# Altium schematic sheet UI.SchDoc
size A
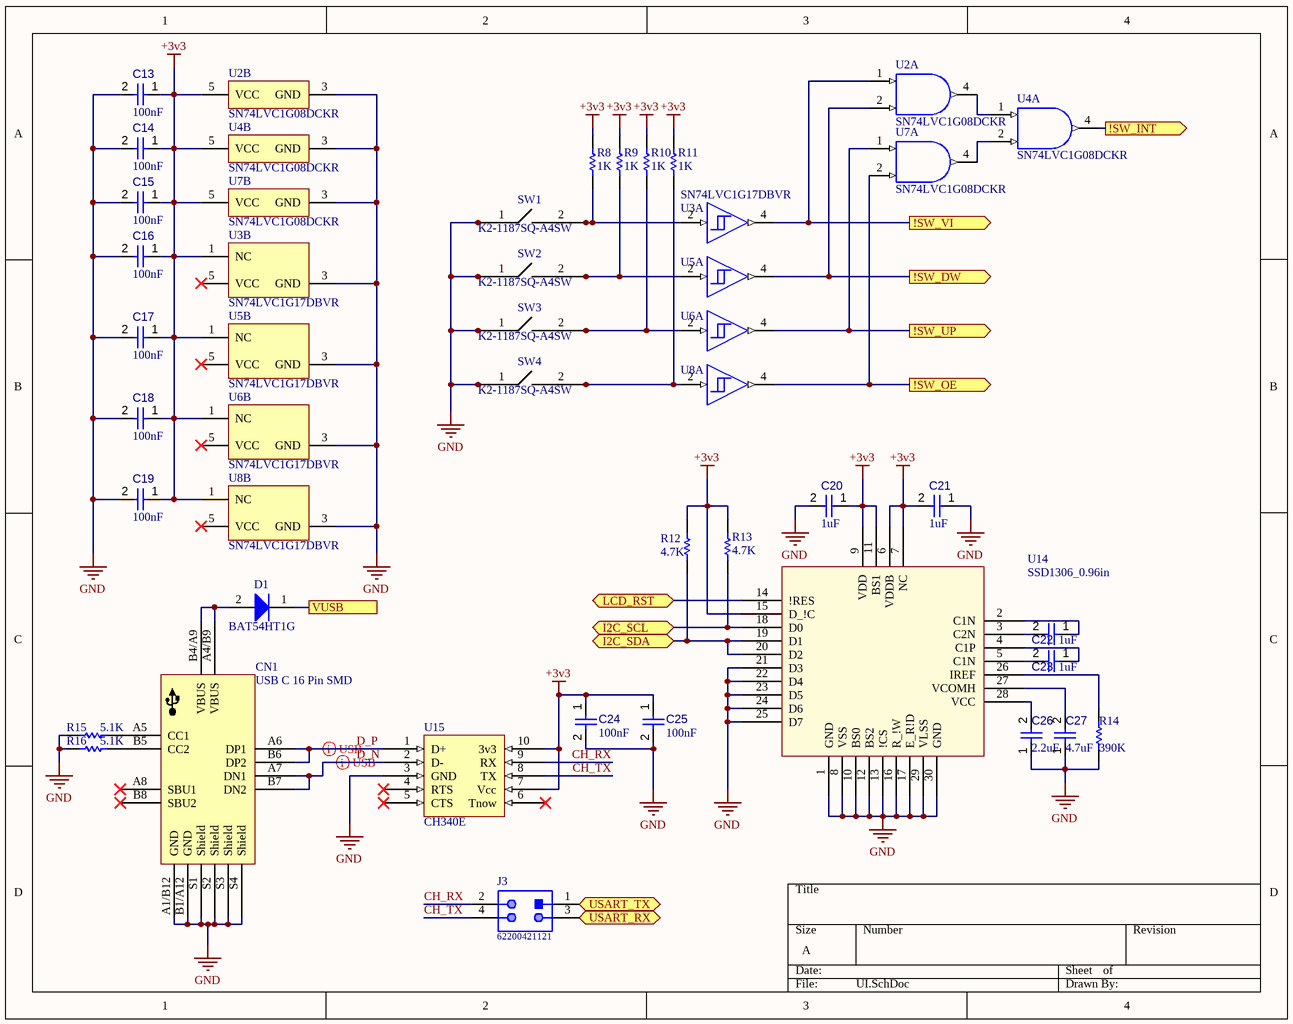
[diagram p0: UI.SchDoc]

## Parts
C13  value 100nF  [CAPC2013X95X50ML10T25]  (hidden comment: Capacitor 100 nF +/-10% 50 V 0805)
C14  value 100nF  [CAPC2013X95X50ML10T25]  (hidden comment: Capacitor 100 nF +/-10% 50 V 0805)
C15  value 100nF  [CAPC2013X95X50ML10T25]  (hidden comment: Capacitor 100 nF +/-10% 50 V 0805)
C16  value 100nF  [CAPC2013X95X50ML10T25]  (hidden comment: Capacitor 100 nF +/-10% 50 V 0805)
C17  value 100nF  [CAPC2013X95X50ML10T25]  (hidden comment: Capacitor 100 nF +/-10% 50 V 0805)
C18  value 100nF  [CAPC2013X95X50ML10T25]  (hidden comment: Capacitor 100 nF +/-10% 50 V 0805)
C19  value 100nF  [CAPC2013X95X50ML10T25]  (hidden comment: Capacitor 100 nF +/-10% 50 V 0805)
C20  value 1uF  [CAPC2013X95X50ML10T25]  (hidden comment: Capacitor 100 nF +/-10% 50 V 0805)
C21  value 1uF  [CAPC2013X95X50ML10T25]  (hidden comment: Capacitor 100 nF +/-10% 50 V 0805)
C22  value 1uF  [CAPC2013X95X50ML10T25]  (hidden comment: Capacitor 100 nF +/-10% 50 V 0805)
C23  value 1uF  [CAPC2013X95X50ML10T25]  (hidden comment: Capacitor 100 nF +/-10% 50 V 0805)
C24  value 100nF  [CAPC2013X95X50ML10T25]  (hidden comment: Capacitor 100 nF +/-10% 50 V 0805)
C25  value 100nF  [CAPC2013X95X50ML10T25]  (hidden comment: Capacitor 100 nF +/-10% 50 V 0805)
C26  value 2.2uF  [CAPC2013X95X50ML10T25]  (hidden comment: Capacitor 100 nF +/-10% 50 V 0805)
C27  value 4.7uF  [CAPC2013X95X50ML10T25]  (hidden comment: Capacitor 100 nF +/-10% 50 V 0805)
CN1  USB C 16 Pin SMD  [USB C 16 Pin SMD-Footprint-1]
D1  BAT54HT1G  [ONSC-SOD-323-2-477-02_V]
J3  62200421121  [62200421121]
R8  value 1K  [RESC2013X50X35ML15T15]  (hidden comment: Resistor 0R +/- 1% 0805 125 mW)
R9  value 1K  [RESC2013X50X35ML15T15]  (hidden comment: Resistor 0R +/- 1% 0805 125 mW)
R10  value 1K  [RESC2013X50X35ML15T15]  (hidden comment: Resistor 0R +/- 1% 0805 125 mW)
R11  value 1K  [RESC2013X50X35ML15T15]  (hidden comment: Resistor 0R +/- 1% 0805 125 mW)
R12  value 4.7K  [RESC2013X50X35ML15T15]  (hidden comment: Resistor 0R +/- 1% 0805 125 mW)
R13  value 4.7K  [RESC2013X50X35ML15T15]  (hidden comment: Resistor 0R +/- 1% 0805 125 mW)
R14  value 390K  [RESC2013X50X35ML15T15]  (hidden comment: Resistor 0R +/- 1% 0805 125 mW)
R15  value 5.1K  [RESC2013X50X35ML15T15]  (hidden comment: Resistor 0R +/- 1% 0805 125 mW)
R16  value 5.1K  [RESC2013X50X35ML15T15]  (hidden comment: Resistor 0R +/- 1% 0805 125 mW)
SW1  K2-1187SQ-A4SW  [K2-1187SQ-A4SW-Footprint-1]
SW2  K2-1187SQ-A4SW  [K2-1187SQ-A4SW-Footprint-1]
SW3  K2-1187SQ-A4SW  [K2-1187SQ-A4SW-Footprint-1]
SW4  K2-1187SQ-A4SW  [K2-1187SQ-A4SW-Footprint-1]
U2  SN74LVC1G08DCKR  [DCK0005A_M]  (parts A,B of 2)
U3  SN74LVC1G17DBVR  [DBV0005A_L]  (parts A,B of 2)
U4  SN74LVC1G08DCKR  [DCK0005A_M]  (parts A,B of 2)
U5  SN74LVC1G17DBVR  [DBV0005A_L]  (value not drawn)  (parts A,B of 2)
U6  SN74LVC1G17DBVR  [DBV0005A_L]  (value not drawn)  (parts A,B of 2)
U7  SN74LVC1G08DCKR  [DCK0005A_M]  (parts A,B of 2)
U8  SN74LVC1G17DBVR  [DBV0005A_L]  (value not drawn)  (parts A,B of 2)
U14  SSD1306_0.96in  [SSD1306_0.96in-Footprint-1]
U15  CH340E  [TSSOP50P490X110-10N]

## Ports
!SW_DW (out), !SW_INT (out), !SW_OE (out), !SW_UP (out), !SW_VI (out), I2C_SCL (bidir), I2C_SDA (bidir), LCD_RST (bidir), USART_RX (bidir), USART_TX (bidir), VUSB

## Nets
+3v3: C13.1 C14.1 C15.1 C16.1 C17.1 C18.1 C19.1 C20.1 C21.2 C24.1 C25.1 R8.2 R9.2 R10.2 R11.2 R12.2 R13.2 U2.5(VCC) U3.1(NC) U4.5(VCC) U5.1(NC) U6.1(NC) U7.5(VCC) U8.1(NC) U14.6(VDDB) U14.7(NC) U14.9(VDD) U14.11(BS1) U14.15(D_!C) U15.7(Vcc) U15.10(3v3)
GND: C13.2 C14.2 C15.2 C16.2 C17.2 C18.2 C19.2 C20.2 C21.1 C24.2 C25.2 C26.1 C27.1 CN1.A1/B12(GND) CN1.B1/A12(GND) CN1.S1(Shield) CN1.S2(Shield) CN1.S3(Shield) CN1.S4(Shield) R14.2 R15.2 R16.2 SW1.1 SW1.3 SW2.1 SW2.3 SW3.1 SW3.3 SW4.1 SW4.3 U2.3(GND) U3.3(GND) U4.3(GND) U5.3(GND) U6.3(GND) U7.3(GND) U8.3(GND) U14.1(GND) U14.8(VSS) U14.10(BS0) U14.12(BS2) U14.13(!CS) U14.16(R_!W) U14.17(E_R!D) U14.21(D3) U14.22(D4) U14.23(D5) U14.24(D6) U14.25(D7) U14.29(VLSS) U14.30(GND) U15.3(GND)
!SW_DW: U2.2(B) U5.4(Y) ; port !SW_DW
!SW_INT: U4.4(Y) ; port !SW_INT
!SW_OE: U7.2(B) U8.4(Y) ; port !SW_OE
!SW_UP: U6.4(Y) U7.1(A) ; port !SW_UP
!SW_VI: U2.1(A) U3.4(Y) ; port !SW_VI
CH_RX: J3.2 U15.9(RX)
CH_TX: J3.4 U15.8(TX)
D_N: CN1.A7(DN1) CN1.B7(DN2) U15.2(D-)
D_P: CN1.A6(DP1) CN1.B6(DP2) U15.1(D+)
I2C_SCL: R13.1 U14.18(D0) ; port I2C_SCL
I2C_SDA: R12.1 U14.19(D1) U14.20(D2) ; port I2C_SDA
LCD_RST: U14.14(!RES) ; port LCD_RST
USART_RX: J3.3 ; port USART_RX
USART_TX: J3.1 ; port USART_TX
VUSB: D1.1(K) ; port VUSB
NetC22_1: C22.1 U14.2(C1N)
NetC22_2: C22.2 U14.3(C2N)
NetC23_1: C23.1 U14.4(C1P)
NetC23_2: C23.2 U14.5(C1N)
NetC26_2: C26.2 U14.28(VCC)
NetC27_2: C27.2 U14.27(VCOMH)
NetCN1_A4/B9: CN1.A4/B9(VBUS) CN1.B4/A9(VBUS) D1.2(A)
NetCN1_A5: CN1.A5(CC1) R15.1
NetCN1_B5: CN1.B5(CC2) R16.1
NetR8_1: R8.1 SW1.2 SW1.4 U3.2(A)
NetR9_1: R9.1 SW2.2 SW2.4 U5.2(A)
NetR10_1: R10.1 SW3.2 SW3.4 U6.2(A)
NetR11_1: R11.1 SW4.2 SW4.4 U8.2(A)
NetR14_1: R14.1 U14.26(IREF)
NetU2_4: U2.4(Y) U4.1(A)
NetU4_2: U4.2(B) U7.4(Y)

Not connected (* = marked no-connect by the designer): CN1 A8(SBU1)* B8(SBU2)* H1(S6) H2(S5); U3 5(VCC)*; U5 5(VCC)*; U6 5(VCC)*; U8 5(VCC)*; U14 31(mech); U15 4(RTS)* 5(CTS)* 6(Tnow)*

## Layout directives
differential pair; differential pair class *; differential pair class *: D_P
differential pair: D_N

## Library data of the parts
C13-C27 = CMP-001-00018-4: Chip Capacitor, 100 nF, +/- 10%, 50 V, 0805 (2012 Metric); Voltage Rating: 50V; Capacitor Type: Ceramic; RoHS Compliant: True; Max Operating Temperature: 125°C; Mounting Technology: SM; Case/Package: 0805; Tolerance: 10%; Min Operating Temperature: -55°C; Pins: 2
CN1 = CMP-002-00071-1: C167321 Jing Extension; ComponentLink1URL: https://datasheet.lcsc.com/szlcsc/1811101520_Jing-Extension-of-the-Electronic-Co-C167321_C167321.pdf; ComponentLink1Description: Datasheet
D1 = CMP-1055-00462-1: Schottky Barrier Diode, 2-Pin SOD-323, Pb-Free, Tape and Reel; Manufacturer: On Semiconductor; Configuration: Single; trr Max (ns): 5; IFSM Max (A): 0.6; ComponentLink3URL: http://www.onsemi.com/pub_link/Collateral/477-02.PDF.1; PackageDescription: 2-Pin SOD, Body 1.7 x 1.25 mm; ComponentLink2URL: http://www.onsemi.cn/pub_link/Collateral/BAT54HT1-D.PDF; ComponentLink3Description: Package Specification; ComponentLink2Description: Datasheet; DatasheetVersion: Rev. 6; PackageReference: SOD-323-2-477-02; RoHS: TRUE; ComponentLink1URL: http://www.onsemi.com/; Packing: Tape and Reel; PartNumber: BAT54HT1G; Mounting Technology: Surface Mount; ComponentLink1Description: Manufacturer URL; PackageVersion: Rev. H, 03/2007
J3 = CMP-1502-00946-1: THT Vertical Pin Header WR-PHD, Pitch 1.27 mm, Dual Row, 4 pins; Manufacturer: Wurth Elektronik; Gender: Male; Contact Resistance: 20mOhm; Pitch: 1.27mm; Rated Current: 1A; Withstanding Voltage: 500VAC; Pin Number: 4; Working Voltage: 100VAC; Part Number: 62200421121; Datasheet URL: https://katalog.we-online.de/em/datasheet/62200421121.pdf; Publisher: WurthElektronik; Mounting Technology: THT; Package Reference: 62200421121; Operating Temperature: -40to105degC; Orientation: Vertical; Row Number: Dual; Packaging: Box; Manufacturer URL: http://www.we-online.de
R8-R16 = CMP-009-00001-4: Chip Resistor, 0 Ohm, +/- 1%, 125 mW, -55 to 155 degC, 0805 (2012 Metric); Power: 125mW; Voltage Rating: 150V; Tolerance: 1%; Mounting Technology: SM; Min Operating Temperature: -55°C; Case/Package: 0805; Pins: 2; Max Operating Temperature: 155°C; RoHS Compliant: True
SW1-SW4 = CMP-011-00013-1: 4 pin SMD switch
U2 U4 U7 = CMP-0859-00266-3: Single 2-Input Positive-AND Gate, DCK0005A, LARGE T&R; Manufacturer: Texas Instruments; tpd @ Nom Voltage(Max)(ns): 4.5,6,4,5; F @ Nom Voltage(Max)(Mhz): 150; ICC @ Nom Voltage(Max)(mA): 0.01; Bits(#): 1; VCC(Min)(V): 1.65; Gate Type: AND; Rating: Catalog; Output Type: CMOS; Voltage(Nom)(V): 1.8,2.5,3.3,5; Technology Family: LVC; VCC(Max)(V): 5.5; Input Type: CMOS/TTL; Schmitt Trigger: No; Output Drive (IOL/IOH)(Max)(mA): 32/-32; Logic: True; Generic Part Number: SN74LVC1G08; DatasheetVersion: SCES217Y; Sub-Family: AND Gate; 3-State Output: No; Operating Temperature Range(C): -40 to 125,-40 to 85; PackageReference: DCK0005A
U3 U5 U6 U8 = CMP-0859-00033-4: Single Schmitt-Trigger Buffer, DBV0005A, LARGE T&R; Manufacturer: Texas Instruments; Output Drive (IOL/IOH)(Max)(mA): 32/-32; Technology Family: LVC; ICC @ Nom Voltage(Max)(mA): 0.01; VCC(Min)(V): 1.65; F @ Nom Voltage(Max)(Mhz): 150; Schmitt Trigger: Yes; Voltage(Nom)(V): 1.8,2.5,3.3,5; 3-State Output: No; Bits(#): 1; VCC(Max)(V): 5.5; Input Type: CMOS/TTL; Logic: True; tpd @ Nom Voltage(Max)(ns): 11,6.5,5.5,5; Output Type: CMOS; Rating: Catalog; Sub-Family: Non-Inverting Buffer/Driver; PackageReference: DBV0005A; DatasheetVersion: SCES351V; Generic Part Number: SN74LVC1G17; Operating Temperature Range(C): -40 to 125,-40 to 85
U14 = CMP-001-0003-2: C91755
U15 = CMP-015-00008-1: USB to UART Converter; Datasheet: https://www.mpja.com/download/35227cpdata.pdf